# EAGLE design theWeather_A (EAGLE 5.11)

## Sheet 1 of 2
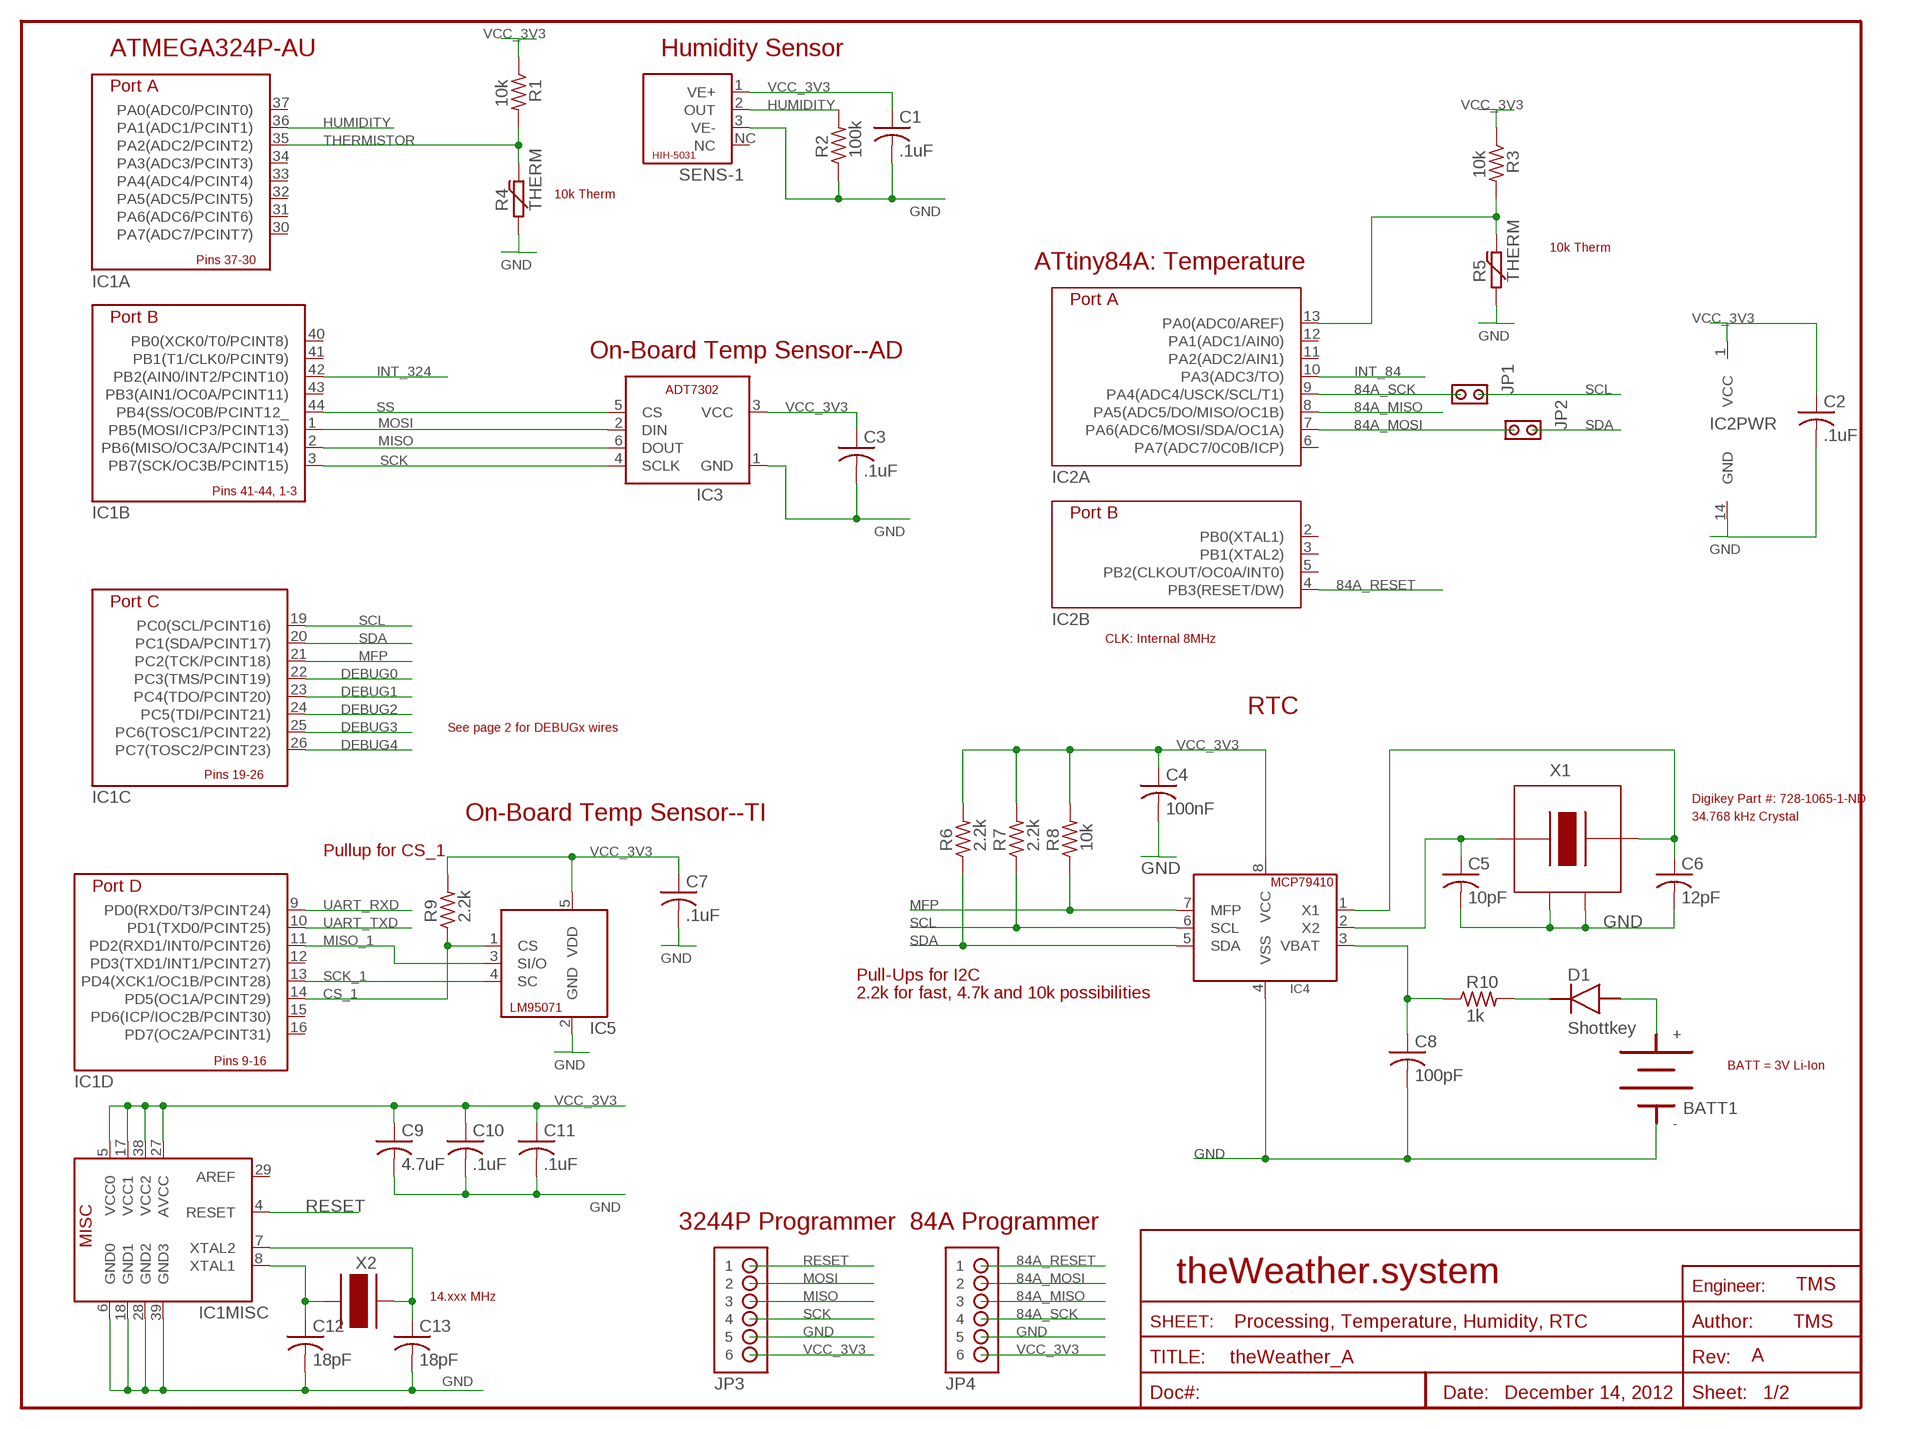
[diagram p0: schematic, sheet 1]

### Parts
BATT1  COINCELL-BR-1632A  [BR-1632A]
C1  .1uF  CAP-S0402  [C0402]
C2  .1uF  CAP-S0402  [C0402]
C3  .1uF  CAP-S0402  [C0402]
C4  100nF  CAP-S0603S  [C0603S]
C5  10pF  CAP-S0603  [C0603]
C6  12pF  CAP-S0603  [C0603]
C7  .1uF  CAP-S0402  [C0402]
C8  100pF  CAP-S0603  [C0603]
C9  4.7uF  CAP-S0603S  [C0603S]
C10  .1uF  CAP-S0402  [C0402]
C11  .1uF  CAP-S0402  [C0402]
C12  18pF  CAP-S0805S  [C0805S]
C13  18pF  CAP-S0805S  [C0805S]
D1  Shottkey  DIODE-DO-214AA  [DO-214AA]
IC1  ATMEGA1284P-AU  [TQFP44]
IC2  ATTINY24-SSU  [SOIC14]
IC3  ADT7302  [SOT23-6]
IC4  MCP79410-SOIC8  [SOIC8]
IC5  LM95071  [SOT23-5]
JP1  JPR-1X2  [JPR-1X2]
JP2  JPR-1X2  [JPR-1X2]
JP3  HDR-1X6-OFFSET  [HDR-1X6_OFFSET]
JP4  HDR-1X6-OFFSET  [HDR-1X6_OFFSET]
R1  10k  RES-S0402  [R0402]
R2  100k  RES-S0402  [R0402]
R3  10k  RES-S0402  [R0402]
R4  THERM  [2-HOLE]
R5  THERM  [2-HOLE]
R6  2.2k  RES-S0402  [R0402]
R7  2.2k  RES-S0402  [R0402]
R8  10k  RES-S0402  [R0402]
R9  2.2k  RES-S0402  [R0402]
R10  1k  RES-S0402  [R0402]
SENS-1  HIH-5031  [HIH-5031]
X1  SSPT7F-7PF20-R  [SSP-T7-FL]
X2  XTAL-TXC-7A  [TXC-7A-SERIES]

### Nets
84A_MISO: IC2.8(A:PA5(ADC5/DO/MISO/OC1B)) JP4.3
84A_MOSI: IC2.7(A:PA6(ADC6/MOSI/SDA/OC1A)) JP2.1 JP4.2
84A_RESET: IC2.4(B:PB3(RESET/DW)) JP4.1
84A_SCK: IC2.9(A:PA4(ADC4/USCK/SCL/T1)) JP1.1 JP4.4
CS_1: IC1.14(D:PD5(OC1A/PCINT29)) IC5.1(CS) R9.1
DEBUG0: IC1.22(C:PC3(TMS/PCINT19)) ; also sheet 2
DEBUG1: IC1.23(C:PC4(TDO/PCINT20)) ; also sheet 2
DEBUG2: IC1.24(C:PC5(TDI/PCINT21)) ; also sheet 2
DEBUG3: IC1.25(C:PC6(TOSC1/PCINT22)) ; also sheet 2
DEBUG4: IC1.26(C:PC7(TOSC2/PCINT23)) ; also sheet 2
GND: BATT1.- C1.2 C2.2 C3.2 C4.2 C5.2 C6.2 C7.2 C8.2 C9.2 C10.2 C11.2 C12.2 C13.2 IC1.6(MISC:GND0) IC1.18(MISC:GND1) IC1.28(MISC:GND2) IC1.39(MISC:GND3) IC2.14(PWR:GND) IC3.1(GND) IC4.4(VSS) IC5.2(GND) JP3.5 JP4.5 R2.1 R4.1 R5.1 SENS-1.3(VE-) X1.2(G2) X1.3(G1) ; also sheet 2
HUMIDITY: IC1.36(A:PA1(ADC1/PCINT1)) R2.2 SENS-1.2(OUT)
INT_84: IC2.10(A:PA3(ADC3/TO)) ; also sheet 2
INT_324: IC1.42(B:PB2(AIN0/INT2/PCINT10)) ; also sheet 2
MFP: IC1.21(C:PC2(TCK/PCINT18)) IC4.7(MFP) R8.1
MISO: IC1.2(B:PB6(MISO/OC3A/PCINT14)) IC3.6(DOUT) JP3.3
MISO_1: IC1.11(D:PD2(RXD1/INT0/PCINT26)) IC5.3(SI/O)
MOSI: IC1.1(B:PB5(MOSI/ICP3/PCINT13)) IC3.2(DIN) JP3.2
N$3: C13.1 IC1.7(MISC:XTAL2) X2.P$1
N$6: C6.1 IC4.1(X1) X1.4
N$8: C12.1 IC1.8(MISC:XTAL1) X2.P$2
N$10: C8.1 IC4.3(VBAT) R10.1
N$11: BATT1.+ D1.ANODE(A)
N$12: D1.CATH(C) R10.2
N$13: IC2.13(A:PA0(ADC0/AREF)) R3.2 R5.2
N$23: C5.1 IC4.2(X2) X1.1
RESET: IC1.4(MISC:RESET) JP3.1
SCK: IC1.3(B:PB7(SCK/OC3B/PCINT15)) IC3.4(SCLK) JP3.4
SCK_1: IC1.13(D:PD4(XCK1/OC1B/PCINT28)) IC5.4(SC)
SCL: IC1.19(C:PC0(SCL/PCINT16)) IC4.6(SCL) JP1.2 R7.1 ; also sheet 2
SDA: IC1.20(C:PC1(SDA/PCINT17)) IC4.5(SDA) JP2.2 R6.1 ; also sheet 2
SS: IC1.44(B:PB4(SS/OC0B/PCINT12_) IC3.5(CS)
THERMISTOR: IC1.35(A:PA2(ADC2/PCINT2)) R1.2 R4.2
UART_RXD: IC1.9(D:PD0(RXD0/T3/PCINT24)) ; also sheet 2
UART_TXD: IC1.10(D:PD1(TXD0/PCINT25)) ; also sheet 2
VCC_3V3: C1.1 C2.1 C3.1 C4.1 C7.1 C9.1 C10.1 C11.1 IC1.5(MISC:VCC0) IC1.17(MISC:VCC1) IC1.27(MISC:AVCC) IC1.38(MISC:VCC2) IC2.1(PWR:VCC) IC3.3(VCC) IC4.8(VCC) IC5.5(VDD) JP3.6 JP4.6 R1.1 R3.1 R6.2 R7.2 R8.2 R9.2 SENS-1.1(VE+) ; also sheet 2
Unconnected: IC1.12(D:PD3(TXD1/INT1/PCINT27)) IC1.15(D:PD6(ICP/IOC2B/PCINT30)) IC1.16(D:PD7(OC2A/PCINT31)) IC1.29(MISC:AREF) IC1.30(A:PA7(ADC7/PCINT7)) IC1.31(A:PA6(ADC6/PCINT6)) IC1.32(A:PA5(ADC5/PCINT5)) IC1.33(A:PA4(ADC4/PCINT4)) IC1.34(A:PA3(ADC3/PCINT3)) IC1.37(A:PA0(ADC0/PCINT0)) IC1.40(B:PB0(XCK0/T0/PCINT8)) IC1.41(B:PB1(T1/CLK0/PCINT9)) IC1.43(B:PB3(AIN1/OC0A/PCINT11)) IC2.2(B:PB0(XTAL1)) IC2.3(B:PB1(XTAL2)) IC2.5(B:PB2(CLKOUT/OC0A/INT0)) IC2.6(A:PA7(ADC7/0C0B/ICP)) IC2.11(A:PA2(ADC2/AIN1)) IC2.12(A:PA1(ADC1/AIN0)) SENS-1.NC

### Notes on the sheet
- ATMEGA324P-AU | Humidity Sensor
- 10k Therm
- 10k Therm
- ATtiny84A: Temperature
- On-Board Temp Sensor--AD
- CLK: Internal 8MHz
- RTC
- See page 2 for DEBUGx wires
- Digikey Part #: 728-1065-1-ND
- On-Board Temp Sensor--TI | 34.768 kHz Crystal
- Pullup for CS_1
- Pull-Ups for I2C
- 2.2k for fast, 4.7k and 10k possibilities
- BATT = 3V Li-Ion
- 3244P Programmer | 84A Programmer
- theWeather.system
- TMS
- 14.xxx MHz
- Processing, Temperature, Humidity, RTC | TMS
- A
- December 14, 2012

## Sheet 2 of 2
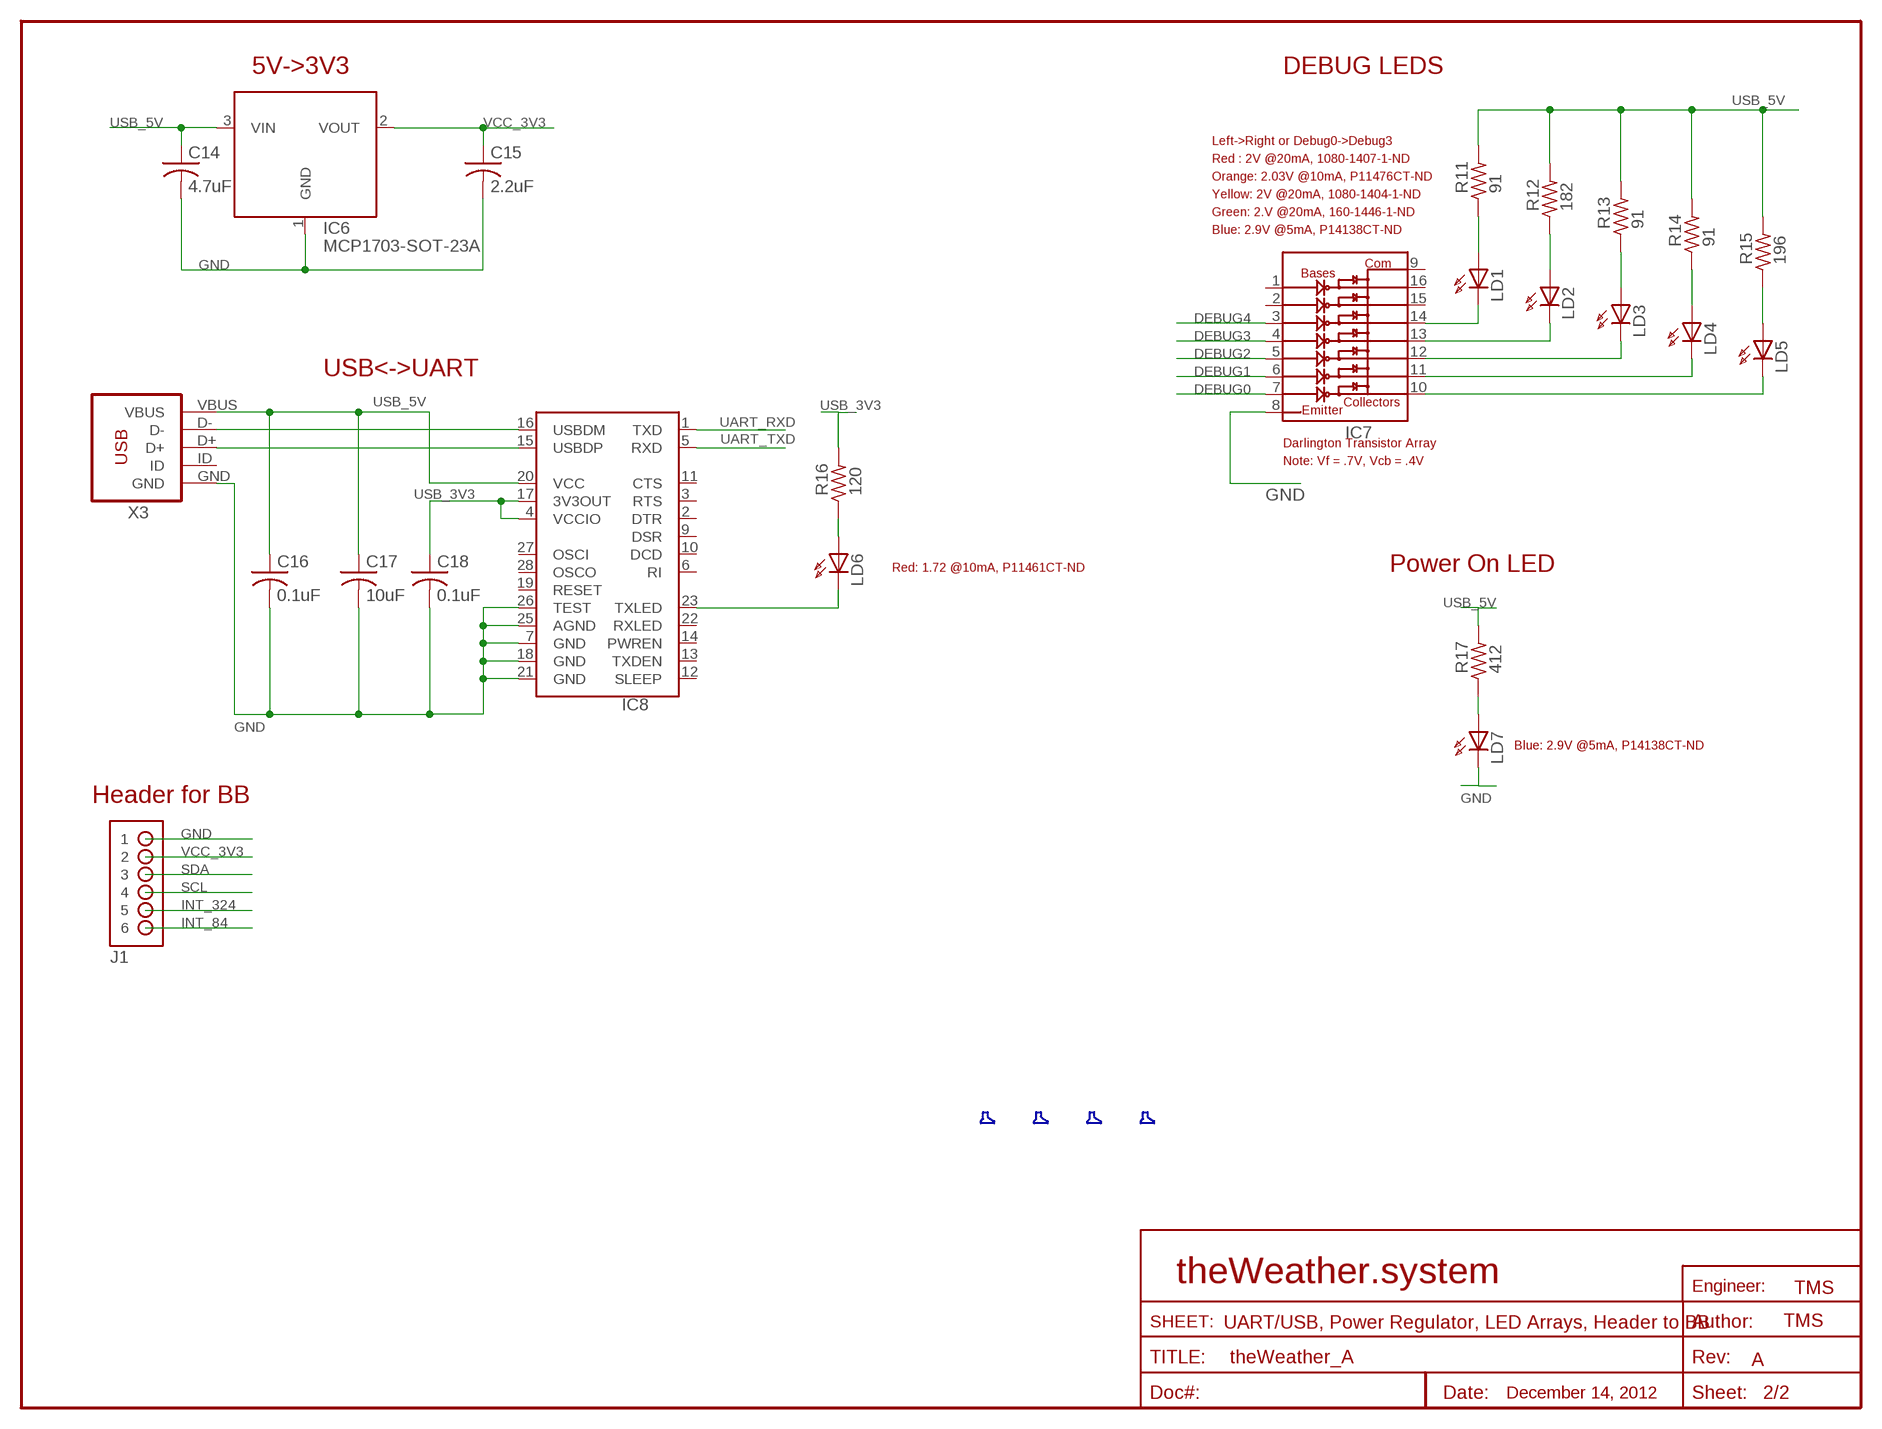
[diagram p1: schematic, sheet 2]

### Parts
C14  4.7uF  CAP-S0603S  [C0603S]
C15  2.2uF  CAP-S0603S  [C0603S]
C16  0.1uF  CAP-S0402P  [C0402P]
C17  10uF  CAP-S0603S  [C0603S]
C18  0.1uF  CAP-S0402P  [C0402P]
F1  FOOT  [FOOT#6]
F2  FOOT  [FOOT#6]
F3  FOOT  [FOOT#6]
F4  FOOT  [FOOT#6]
IC6  MCP1703-SOT-23A  [SOT-23A]
IC7  ULQ2004A-Q1-TSSOP-16  [TSSOP-16]
IC8  FT232R  [SSOP28L]
J1  HDR-2X3  [HDR-2X3]
LD1  LED-S0603  [D0603]
LD2  LED-S0603  [D0603]
LD3  LED-S0603  [D0603]
LD4  LED-S0603  [D0603]
LD5  LED-S0603  [D0603]
LD6  LED-S0603  [D0603]
LD7  LED-S0603  [D0603]
R11  91  RES-S0402  [R0402]
R12  182  RES-S0402  [R0402]
R13  91  RES-S0402  [R0402]
R14  91  RES-S0402  [R0402]
R15  196  RES-S0402  [R0402]
R16  120  RES-S0402  [R0402]
R17  412  RES-S0402  [R0402]
X3  USB-MINI-B-OTG-MOLEX_67503-1020  [USB-MINI-B-OTG]

### Nets
DEBUG0: IC7.7 ; also sheet 1
DEBUG1: IC7.6 ; also sheet 1
DEBUG2: IC7.5 ; also sheet 1
DEBUG3: IC7.4 ; also sheet 1
DEBUG4: IC7.3 ; also sheet 1
GND: C14.2 C15.2 C16.2 C17.2 C18.2 IC6.1(GND) IC7.8 IC8.7(GND) IC8.18(GND) IC8.21(GND) IC8.25(AGND) IC8.26(TEST) J1.1 LD7.C X3.GND ; also sheet 1
INT_84: J1.6 ; also sheet 1
INT_324: J1.5 ; also sheet 1
N$2: IC8.16(USBDM) X3.D-
N$4: LD6.A R16.1
N$5: IC8.15(USBDP) X3.D+
N$9: IC8.23(TXLED) LD6.C
N$14: LD1.A R11.1
N$15: LD2.A R12.1
N$16: LD3.A R13.1
N$17: LD4.A R14.1
N$18: IC7.14 LD1.C
N$19: LD7.A R17.1
N$20: IC7.13 LD2.C
N$21: IC7.12 LD3.C
N$22: IC7.11 LD4.C
N$24: IC7.10 LD5.C
N$25: LD5.A R15.1
SCL: J1.4 ; also sheet 1
SDA: J1.3 ; also sheet 1
UART_RXD: IC8.1(TXD) ; also sheet 1
UART_TXD: IC8.5(RXD) ; also sheet 1
USB_3V3: C18.1 IC8.4(VCCIO) IC8.17(3V3OUT) R16.2
USB_5V: C14.1 C16.1 C17.1 IC6.3(VIN) IC8.20(VCC) R11.2 R12.2 R13.2 R14.2 R15.2 R17.2 X3.VBUS
VCC_3V3: C15.1 IC6.2(VOUT) J1.2 ; also sheet 1
Unconnected: IC7.1 IC7.2 IC7.9 IC7.15 IC7.16 IC8.2(DTR) IC8.3(RTS) IC8.6(RI) IC8.9(DSR) IC8.10(DCD) IC8.11(CTS) IC8.12(SLEEP) IC8.13(TXDEN) IC8.14(PWREN) IC8.19(RESET) IC8.22(RXLED) IC8.27(OSCI) IC8.28(OSCO) X3.ID

### Notes on the sheet
- 5V->3V3 | DEBUG LEDS
- Left->Right or Debug0->Debug3
- Red : 2V @20mA, 1080-1407-1-ND
- Orange: 2.03V @10mA, P11476CT-ND
- Yellow: 2V @20mA, 1080-1404-1-ND
- Green: 2.V @20mA, 160-1446-1-ND
- Blue: 2.9V @5mA, P14138CT-ND
- USB<->UART
- Darlington Transistor Array
- Note: Vf = .7V, Vcb = .4V
- Red: 1.72 @10mA, P11461CT-ND | Power On LED
- Blue: 2.9V @5mA, P14138CT-ND
- Header for BB
- theWeather.system
- TMS
- UART/USB, Power Regulator, LED Arrays, Header to BB | TMS
- A
- December 14, 2012

## Library data of the parts
BATT1 = Mechanical:COINCELL
C1-C18 = Discrete:CAP: Capacitor
D1 = Discrete:DIODE: Diode
F1-F4 = Mechanical:FOOT: Foot (ie. #6 screw, or Rubber)
IC1 = Atmel:ATMEGA1284P-AU: Atmega1284P-AU, TQFP44 Package, Digikey: ATMEGA1284P-AURCT-ND, 128kb Flash, 3 SPI, 2 USART, 1 I2C
IC2 = Atmel:ATTINY24: ATtiny24-44-84 AVR Microcontroller
IC3 = IC:ADT7302: Analog Devices Digital Thermometer, Digikey Part Number: ADT7302ARTZ-REEL7CT-ND, Takes ADC reading and then talks via 3/4 wire SPI to a uC
IC4 = IC:MCP79410: Digi-Key Part Number MCP79410-I/SN-ND Manufacturer Part Number MCP79410-I/SN Description IC RTC ALARM NVSRAM 8SOIC Microchip MCP79410 The MCP7941X series of low-power Real-Time Clocks (RTC) uses digital timing compensation for an accurate clock/calendar, a programmable output control for versatility, a power sense circuit that automatically switches to the backup supply, and nonvolatile memory for data storage. Using a low-cost 32.768 kHz crystal, it tracks time using several internal registers. For communication, the MCP7941X uses the I2C? bus.
IC5 = TI:LM95071: Texas Instruments Temperature Sensor, Digikey Part Number: LM95071CIMF/NOPBCT-ND
IC6 = Microchip:MCP1703: Digi-Key Part Number MCP1703T-3302E/CBCT-ND Manufacturer Microchip Technology Manufacturer Part Number MCP1703T-3302E/CB Description IC REG LDO 3.3V 250MA SOT-23A
IC7 = Discrete:ULQ2004A-Q1: Digi-Key Part Number 296-27409-1-ND Manufacturer Texas Instruments Manufacturer Part Number ULQ2003ATPWRQ1 Description IC DARLINGTN TRANS ARRAY 16TSSOP The ULQ2003A and ULQ2004A are high-voltage high-current Darlington transistor arrays. Each consists of seven npn Darlington pairs that feature high-voltage outputs with common-cathode clamp diodes for switching inductive loads. The collector-current rating of a single Darlington pair is 500 mA. The Darlington pairs can be paralleled for higher current capability. Applications include relay drivers, hammer drivers, lamp drivers, display drivers (LED and gas discharge), line drivers, and logic buffers.
IC8 = IC:FT232R: The FT232R is a USB to serial UART interface with the following advanced features: Data transfer rates from 300 baud to 3 Mbaud (RS422, RS485, RS232 ) at TTL levels. 128 byte receive buffer and 256 byte transmit buffer utilising buffer smoothing technology to allow for high data throughput. FTDI?s royalty-free Virtual Com Port (VCP) and Direct (D2XX) drivers eliminate the requirement
J1 = Mechanical:HDR-2X3
JP1 JP2 = Mechanical:JPR-1X2
JP3 JP4 = Mechanical:HDR-1X6-OFFSET: 42 mil hole pattern with 16mil offset for jtag connector
LD1-LD7 = Discrete:LED: Discrete LED
R1-R3 R6-R17 = Discrete:RES: Resistor
R4 R5 = Discrete:THERM: Standard Thermistor. 2-Hole Digikey Part # 615-1083-ND
SENS-1 = Misc:HIH-5031: Honeywell Humidity Sensor, Manufacture Part #: HIH-5031, Digikey Part #: 480-3294-2-ND
X1 = Discrete:SSPT7F-7PF20-R
X2 = Discrete:XTAL: Quartz Crystal
X3 = Mechanical:USB-MINI-B-OTG: Molex 67503-1020 USB mini B connector with through hole anchors.

## Board
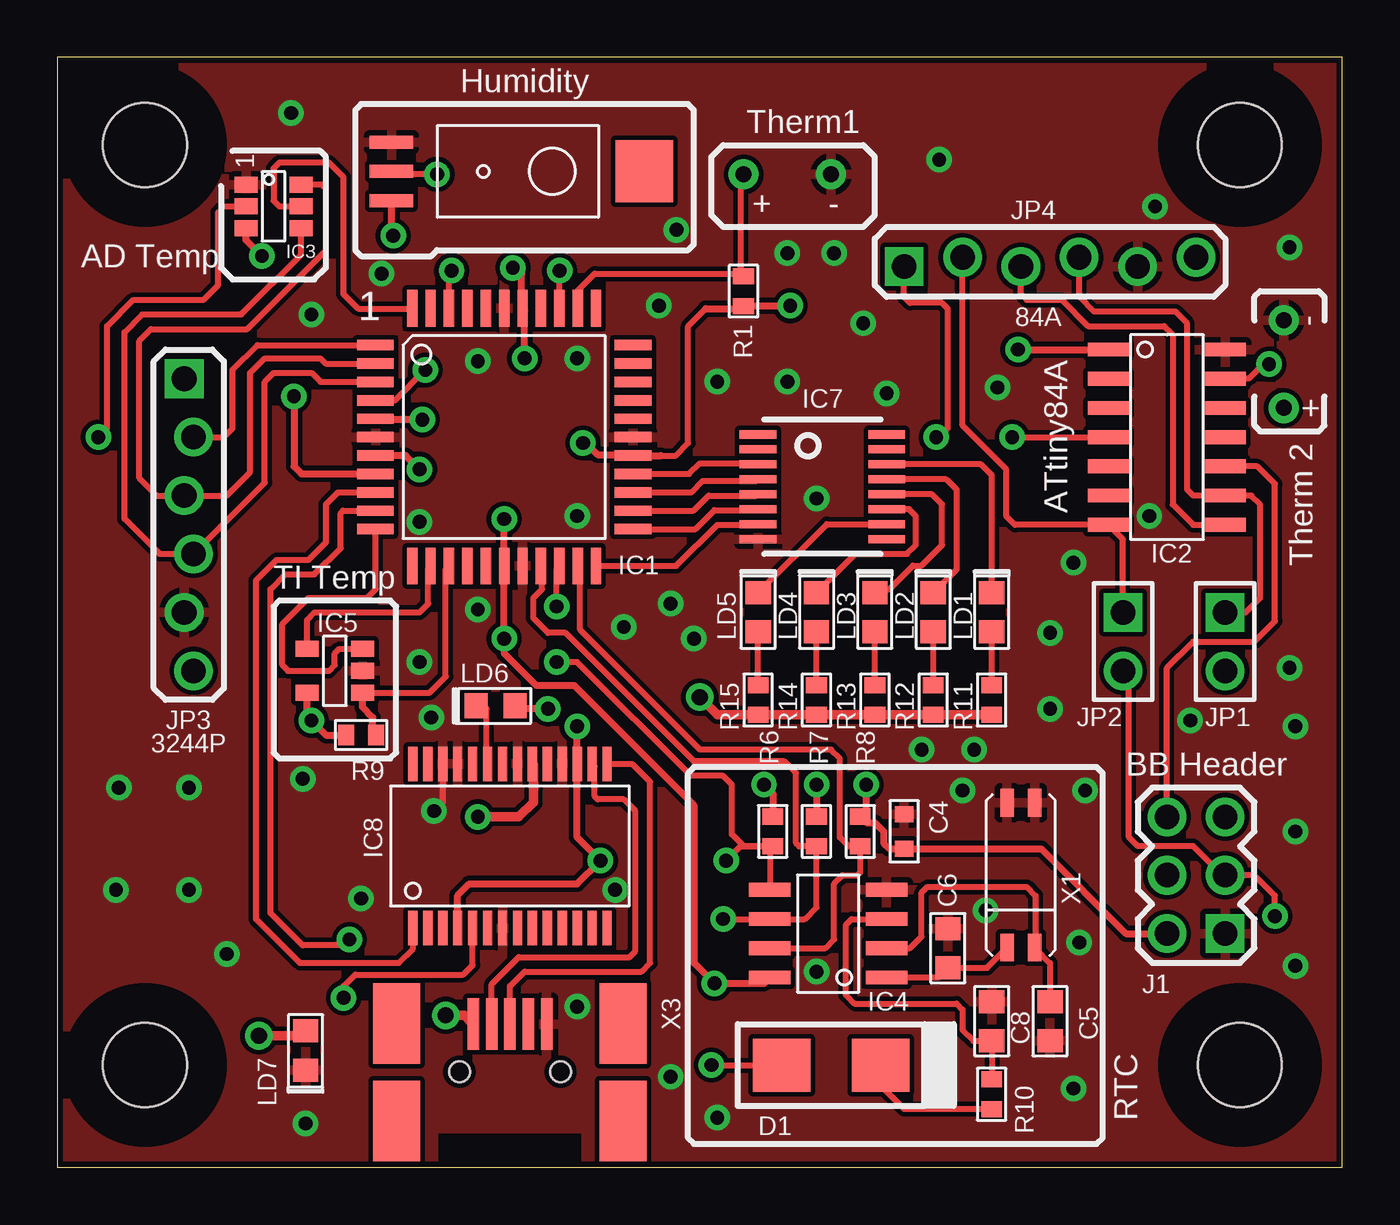
[diagram p2: board, top side]
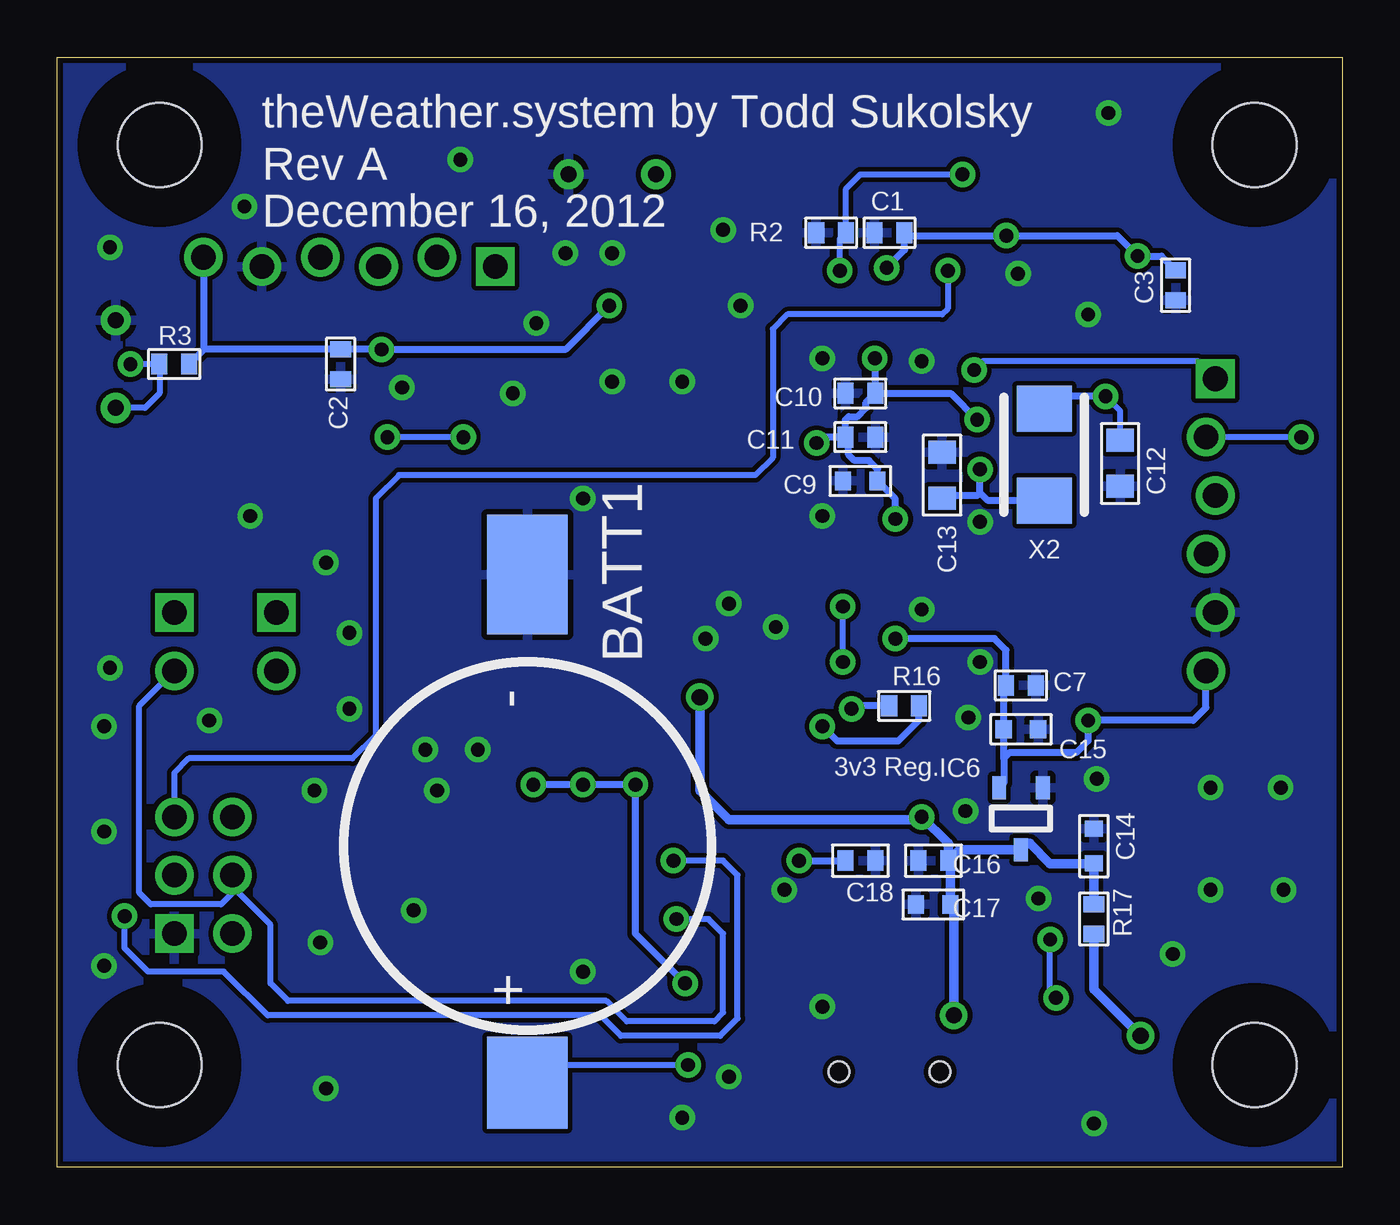
[diagram p3: board, bottom side, seen from below]

Size 55.88 x 48.26 mm. Coordinates in mm from the lower left corner, seen from the top.
Outline: 0,0 55.88,0 55.88,48.26 0,48.26 0,0
Copper layers (1*16): Top 0.035mm / dielectric 1.5mm / Bottom 0.035mm
Design rules "batchPCB": minimum track width 8mil, minimum drill 20mil, track to track 8mil, track to pad 8mil, pad to pad 8mil, via to via 8mil, smd to smd 8mil, copper to edge 10mil, drill to drill 8mil, minimum pad ring 12mil, minimum via ring 10mil, stop-mask expansion 4mil, vias tented up to drill 25mil, thermal gap 10mil

### Footprints (pad centres in the part's own frame; a part is rotated, then mirrored left to right if it is on the bottom)
BR-1632A = smd 4 x 3.5: + -10.3,0 | smd 5.2 x 3.5: - 11.8,0
C0402 = smd 0.7 x 0.9: 1 -0.65,0; 2 0.65,0
C0603S = smd 0.7 x 0.8: 1 -0.75,0; 2 0.75,0
C0603 = smd 1 x 1.1: 1 -0.85,0; 2 0.85,0
C0805S = smd 1 x 1.2: 1 -1,0; 2 1,0
C0402P = smd 0.7 x 0.9: 1 -0.65,0; 2 0.65,0
DO-214AA = smd 2.5 x 2.3: ANODE -2.15,0; CATH 2.15,0
FOOT#6 = hole 3.658: 0,0
TQFP44 = smd 1.6 x 0.45: 1 -5.6,4; 2 -5.6,3.2; 3 -5.6,2.4; 4 -5.6,1.6; 5 -5.6,0.8; 6 -5.6,0; 7 -5.6,-0.8; 8 -5.6,-1.6; 9 -5.6,-2.4; 10 -5.6,-3.2; 11 -5.6,-4; 23 5.6,-4; 24 5.6,-3.2; 25 5.6,-2.4; 26 5.6,-1.6; 27 5.6,-0.8; 28 5.6,0; 29 5.6,0.8; 30 5.6,1.6; 31 5.6,2.4; 32 5.6,3.2; 33 5.6,4 | smd 0.45 x 1.6: 12 -4,-5.6; 13 -3.2,-5.6; 14 -2.4,-5.6; 15 -1.6,-5.6; 16 -0.8,-5.6; 17 0,-5.6; 18 0.8,-5.6; 19 1.6,-5.6; 20 2.4,-5.6; 21 3.2,-5.6; 22 4,-5.6; 34 4,5.6; 35 3.2,5.6; 36 2.4,5.6; 37 1.6,5.6; 38 0.8,5.6; 39 0,5.6; 40 -0.8,5.6; 41 -1.6,5.6; 42 -2.4,5.6; 43 -3.2,5.6; 44 -4,5.6
SOIC14 = smd 0.6 x 1.8: 1 -3.81,-2.54; 2 -2.54,-2.54; 3 -1.27,-2.54; 4 0,-2.54; 5 1.27,-2.54; 6 2.54,-2.54; 7 3.81,-2.54; 8 3.81,2.54; 9 2.54,2.54; 10 1.27,2.54; 11 0,2.54; 12 -1.27,2.54; 13 -2.54,2.54; 14 -3.81,2.54
SOT23-6 = smd 0.7 x 1: 1 -0.95,-1.2; 2 0,-1.2; 3 0.95,-1.2; 4 0.95,1.2; 5 0,1.2; 6 -0.95,1.2
SOIC8 = smd 0.6 x 1.8: 1 -1.905,-2.54; 2 -0.635,-2.54; 3 0.635,-2.54; 4 1.905,-2.54; 5 1.905,2.54; 6 0.635,2.54; 7 -0.635,2.54; 8 -1.905,2.54
SOT23-5 = smd 0.7 x 1: 1 -0.95,-1.2; 2 0,-1.2; 3 0.95,-1.2; 4 0.95,1.2; 5 -0.95,1.2
SOT-23A = smd 0.6 x 1: 1 -0.95,0; 2 0.95,0; 3 0,2.7
TSSOP-16 = smd 0.35 x 1.6: 1 -2.275,-2.8; 2 -1.625,-2.8; 3 -0.975,-2.8; 4 -0.325,-2.8; 5 0.325,-2.8; 6 0.975,-2.8; 7 1.625,-2.8; 8 2.275,-2.8; 9 2.275,2.8; 10 1.625,2.8; 11 0.975,2.8; 12 0.325,2.8; 13 -0.325,2.8; 14 -0.975,2.8; 15 -1.625,2.8; 16 -2.275,2.8
SSOP28L = smd 0.4 x 1.5: 1 -4.225,-3.575; 2 -3.575,-3.575; 3 -2.925,-3.575; 4 -2.275,-3.575; 5 -1.625,-3.575; 6 -0.975,-3.575; 7 -0.325,-3.575; 8 0.325,-3.575; 9 0.975,-3.575; 10 1.625,-3.575; 11 2.275,-3.575; 12 2.925,-3.575; 13 3.575,-3.575; 14 4.225,-3.575; 15 4.225,3.575; 16 3.575,3.575; 17 2.925,3.575; 18 2.275,3.575; 19 1.625,3.575; 20 0.975,3.575; 21 0.325,3.575; 22 -0.325,3.575; 23 -0.975,3.575; 24 -1.625,3.575; 25 -2.275,3.575; 26 -2.925,3.575; 27 -3.575,3.575; 28 -4.225,3.575
HDR-2X3 = drill 1.067 square: 1 -1.27,2.54 | drill 1.067 round: 2 1.27,2.54; 3 -1.27,0; 4 1.27,0; 5 -1.27,-2.54; 6 1.27,-2.54
JPR-1X2 = drill 1.067 square: 1 0,1.27 | drill 1.067 round: 2 0,-1.27
HDR-1X6_OFFSET = drill 1.067 square: 1 -0.203,6.35 | drill 1.067 round: 2 0.203,3.81; 3 -0.203,1.27; 4 0.203,-1.27; 5 -0.203,-3.81; 6 0.203,-6.35
D0603 = smd 1 x 1.1: A 0.85,0; C -0.85,0
R0402 = smd 0.7 x 0.9: 1 -0.65,0; 2 0.65,0
2-HOLE = drill 0.7 round: 1 -1.905,0; 2 1.905,0
HIH-5031 = smd 0.57 x 1.9: 1 1.27,-11; 2 0,-11; 3 -1.27,-11 | smd 2.7 x 2.5: NC 0,0
SSP-T7-FL = smd 1.2 x 0.6: 1 -3.15,-0.6; 2 3.15,-0.6; 3 3.15,0.6; 4 -3.15,0.6
TXC-7A-SERIES = smd 2 x 2.4: P$1 -2,0; P$2 2,0
USB-MINI-B-OTG = smd 2.25 x 0.5: D+ 5.975,0; D- 5.975,0.8; GND 5.975,-1.6; ID 5.975,-0.8; VBUS 5.975,1.6 | smd 3.5 x 2.05: SHLD1 1.75,4.925; SHLD2 6,4.925; SHLD3 1.75,-4.925; SHLD4 6,-4.925 | hole 0.9: 3.9,2.2; 3.9,-2.2

### Placement (x,y rotation side)
BATT1  35.43,13.97 90 bottom
C1  19.68,40.64 180 bottom
C2  43.56,34.92 270 bottom
C3  7.24,38.35 270 bottom
C4  36.83,14.61 90 top
C5  43.18,6.35 270 top
C6  38.73,9.53 90 top
C7  13.97,20.95 0 bottom
C8  40.64,6.35 90 top
C9  20.95,29.84 180 bottom
C10  20.95,33.66 180 bottom
C11  20.95,31.75 0 bottom
C12  9.65,30.61 270 bottom
C13  17.4,30.1 90 bottom
C14  10.79,13.97 90 bottom
C15  13.97,19.05 0 bottom
C16  17.78,13.34 180 bottom
C17  17.78,11.43 180 bottom
C18  20.95,13.34 0 bottom
D1  33.66,4.45 0 top
F1  51.44,4.45 0 top
F2  3.81,4.45 0 top
F3  3.81,44.45 0 top
F4  51.44,44.45 0 top
IC1  19.43,31.75 0 top
IC2  48.26,31.75 270 top
IC3  9.4,41.78 270 top
IC4  33.53,10.16 90 top
IC5  12.06,21.59 90 top
IC6  13.97,16.51 180 bottom
IC7  33.27,29.59 270 top
IC8  19.68,13.97 0 top
J1  49.53,12.7 180 top
JP1  50.8,22.86 0 top
JP2  46.35,22.86 0 top
JP3  5.71,27.94 0 top
JP4  43.18,39.37 90 top
LD1  40.64,24.13 270 top
LD2  38.1,24.13 270 top
LD3  35.56,24.13 270 top
LD4  33.02,24.13 270 top
LD5  30.48,24.13 270 top
LD6  19.05,20.07 0 top
LD7  10.79,5.08 90 top
R1  29.84,38.1 90 top
R2  22.23,40.64 0 bottom
R3  50.8,34.92 180 bottom
R4  31.75,43.18 180 top
R5  53.34,34.92 270 top
R6  31.11,14.61 90 top
R7  33.02,14.61 90 top
R8  34.92,14.61 90 top
R9  13.21,18.8 180 top
R10  40.64,3.17 270 top
R11  40.64,20.32 270 top
R12  38.1,20.32 270 top
R13  35.56,20.32 270 top
R14  33.02,20.32 270 top
R15  30.48,20.32 270 top
R16  19.05,20.07 0 bottom
R17  10.79,10.79 90 bottom
SENS-1  25.53,43.31 270 top
X1  41.91,12.7 90 top
X2  12.95,30.99 90 bottom
X3  19.68,0.25 90 top

### Tracks (layer width: path | path; a pad name or v marks a point on that pad's centre or on a via)
84A_MISO
  Top 0.254: IC2.8 49.4,27.94 48.51,28.83 48.51,36.2 48.13,36.58 44.83,36.58 43.69,37.72 42.16,37.72 41.91,37.97 JP4.3
84A_MOSI
  Top 0.254: JP2.1 46.35,27.3 IC2.7 41.66,27.94 41.27,28.32 41.27,30.35 39.37,32.26 JP4.2
84A_RESET  (via drill 0.6)
  Top 0.254: v41.53,31.75 IC2.4 | v38.23,31.75 38.35,31.75 38.73,32.13 38.73,37.34 38.48,37.59 37.08,37.59 36.83,37.85 JP4.1
  Bottom 0.254: v38.23,31.75 v41.53,31.75
84A_SCK
  Top 0.254: JP1.1 51.69,24.13 52.32,24.77 52.32,28.83 51.94,29.21 IC2.9 49.4,29.21 49.15,29.46 49.15,36.7 48.64,37.21 45.09,37.21 44.45,37.85 JP4.4
CS_1
  Top 0.254: IC5.1 16.2,20.64 16.89,21.34 16.89,26.01 IC1.14
  Top 0.305: IC5.1 13.27,20.01 13.72,19.56 13.72,18.94 R9.1
DEBUG0
  Top 0.254: IC1.22 26.91,26.15 28.7,27.94 30.45,27.94 IC7.7
DEBUG1
  Top 0.254: IC1.23 27.75,27.75 28.57,28.57 30.43,28.57 IC7.6
DEBUG2
  Top 0.254: IC1.24 27.66,28.55 28.32,29.21 30.42,29.21 IC7.5
DEBUG3
  Top 0.254: IC1.25 27.57,29.35 28.07,29.84 30.4,29.84 IC7.4
DEBUG4
  Top 0.254: IC1.26 27.48,30.15 27.94,30.61 30.43,30.61 IC7.3
GND  (via drill 0.6)
  Top 0.254: IC8.26 16.76,15.87 v16.38,15.49
  other vias: 22.61,6.99 15.75,21.97 16.26,19.56 7.37,9.27 24.26,12.06 40.39,11.18 10.67,16.89 13.21,11.68 11.05,37.08 14.1,38.86 18.29,35.05 2.67,16.51 5.71,16.51 2.54,12.06 5.71,12.06 10.79,1.91 18.29,24.26 24.64,23.5 26.67,24.51 27.69,22.99 22.61,28.32 15.75,28.07 22.61,35.18 28.7,34.16 31.75,34.16 33.02,29.08 36.07,33.66 44.2,26.29 40.89,33.91 35.05,36.7 33.78,39.75 26.16,37.47 26.92,40.77 10.16,45.85 38.35,43.81 31.75,39.75 47.75,41.78 53.59,40.01 47.5,28.32 43.18,23.24 53.59,21.72 49.28,19.43 43.18,19.94 37.59,18.16 39.88,18.16 39.37,16.38 44.7,16.38 44.45,9.78 44.2,3.43 28.7,2.16 33.02,8.51 26.67,3.94 53.85,8.76 53.85,14.61 53.85,19.18
  pour Bottom: 0,48.26 55.88,48.26 55.88,0 0,0
  pour Top: 0,48.26 55.88,48.26 55.88,0 0,0
HUMIDITY  (via drill 0.6)
  Top 0.254: IC1.36 21.83,38.98 v21.84,38.99 | v16.51,43.18 14.65,43.18 SENS-1.2
  Bottom 0.254: v21.84,38.99 21.84,40.37 R2.2 21.57,42.56 20.95,43.18 v16.51,43.18
INT_84
  Top 0.254: J1.6 48.26,21.72 49.4,22.86 52.07,22.86 52.96,23.75 52.96,29.72 52.2,30.48 IC2.10
INT_324  (via drill 0.6)
  Top 0.254: IC1.42 17.03,38.88 v17.14,38.99
  Bottom 0.254: v17.14,38.99 17.14,37.34 17.4,37.08 24.13,37.08 24.77,36.45 24.77,30.86 25.53,30.1 41.02,30.1 42.04,29.08 42.04,18.8 43.05,17.78 50.16,17.78 50.8,17.14 J1.5
MFP
  Top 0.254: IC4.7 33.4,9.53 33.78,9.91 33.78,12.32 34.16,12.7 34.8,12.7 34.92,12.83 R8.1 34.43,13.96 34.04,14.35 34.04,17.78 33.66,18.16 27.94,18.16 22.73,23.37 22.73,26.05 IC1.21
MISO
  Top 0.254: IC1.2 11.66,34.95 11.43,35.18 9.02,35.18 8.38,34.54 8.38,30.23 7.37,29.21 JP3.3 4.32,29.21 3.56,29.97 3.56,35.94 4.06,36.45 8.26,36.45 11.68,39.88 11.68,42.55 11.5,42.73 IC3.6
MISO_1
  Top 0.254: IC5.3 12.25,22.54 12.06,22.35 12.06,21.84 11.81,21.59 10.03,21.59 9.78,21.84 9.78,23.62 10.92,24.77 13.46,24.77 13.84,25.15 13.84,27.74 IC1.11
MOSI  (via drill 0.6)
  Top 0.254: IC1.1 8.7,35.75 7.62,34.67 7.62,32.13 7.24,31.75 JP3.2 | IC3.2 7.24,41.78 6.99,41.53 6.99,38.35 6.35,37.72 3.3,37.72 2.16,36.58 2.16,32.13 v1.78,31.75
  Bottom 0.254: v1.78,31.75 JP3.2
N$2
  Top 0.254: X3.D- 18.89,7.96 20.07,9.14 24.89,9.14 25.15,9.4 25.15,15.49 24.64,16 23.5,16 23.37,16.13 23.37,17.44 IC8.16
N$3  (via drill 0.6)
  Top 0.305: IC1.7 15.15,30.95 v15.75,30.35
  Bottom 0.305: 15.75,29.34 v15.75,30.35 | 15.75,29.34 15.88,29.21 17.29,29.21 C13.1 | X2.P$1 15.4,28.99 15.75,29.34
N$4  (via drill 0.6)
  Top 0.305: v21.34,19.94 20.03,19.94 LD6.A
  Bottom 0.305: R16.1 21.21,20.07 v21.34,19.94
N$5
  Top 0.254: X3.D+ 19.68,7.87 20.32,8.51 25.4,8.51 25.78,8.89 25.78,16.76 25.02,17.53 23.93,17.53 IC8.15
N$6
  Top 0.254: IC4.1 38.31,8.26 C6.1 40.44,8.68 X1.4
N$8  (via drill 0.6)
  Top 0.305: IC1.8 10.62,30.15 10.29,30.48 v10.29,33.53
  Bottom 0.254: C12.1 9.65,32.89 v10.29,33.53
  Bottom 0.305: v10.29,33.53 12.41,33.53 X2.P$2
N$9
  Top 0.254: LD6.C 18.54,20.07 18.67,19.94 18.67,17.59 IC8.23
N$10
  Top 0.254: R10.1 C8.1 39.84,5.5 39.37,5.97 39.37,6.86 39.12,7.11 34.67,7.11 34.29,7.49 34.29,10.54 34.54,10.79 IC4.3
N$11  (via drill 0.6)
  Top 0.254: v28.45,4.45 D1.ANODE
  Bottom 0.254: v28.45,4.45 34.66,4.45 BATT1.+
N$12
  Top 0.254: D1.CATH 35.8,3.56 36.83,2.54 40.62,2.54 R10.2
N$13  (via drill 0.6)
  Top 0.254: v52.7,34.92 52.45,34.92 51.82,34.29 IC2.13
  Bottom 0.254: v52.7,34.92 R3.2 51.44,34.91 51.44,33.66 52.07,33.02 R5.2
N$14
  Top 0.254: R11.1 LD1.A
N$15
  Top 0.254: R12.1 LD2.A
N$16
  Top 0.254: R13.1 LD3.A
N$17
  Top 0.254: R14.1 LD4.A
N$18
  Top 0.254: IC7.14 40.17,30.57 40.64,30.1 LD1.C
N$19  (via drill 0.7)
  Top 0.406: v8.76,5.71 10.58,5.71 LD7.A
  Bottom 0.406: R17.1 10.79,7.75 v8.76,5.71
N$20
  Top 0.254: IC7.13 38.66,29.92 39.12,29.46 39.12,26 LD2.C
N$21
  Top 0.254: IC7.12 38.04,29.27 38.48,28.83 38.48,27.05 37.59,26.16 37.21,26.16 36.2,25.15 35.73,25.15 LD3.C 35.6,25.02
N$22
  Top 0.254: IC7.11 37.04,28.62 37.34,28.32 37.34,27.05 36.96,26.67 34.71,26.67 LD4.C
N$23
  Top 0.254: C5.1 43.18,8.88 X1.1 42.55,9.59 42.55,11.81 42.16,12.19 37.85,12.19 37.59,11.94 37.59,10.03 37.08,9.53 IC4.2
N$24
  Top 0.254: IC7.10 33.47,27.97 LD5.C
N$25
  Top 0.254: R15.1 LD5.A
RESET  (via drill 0.6)
  Top 0.254: IC1.4 14.68,33.35 v16,34.67
  Bottom 0.254: v16,34.67 15.62,35.05 6.27,35.05 JP3.1
SCK
  Top 0.254: IC1.3 11.44,34.15 11.05,34.54 9.4,34.54 9.02,34.16 9.02,29.77 JP3.4 4.45,26.67 2.92,28.19 2.92,36.32 3.68,37.08 8,37.08 10.6,39.68 IC3.4
SCK_1
  Top 0.254: IC5.4 10.87,23.82 11.18,24.13 15.75,24.13 16.13,24.51 16.13,26.05 IC1.13
SCL  (via drill 0.6)
  Top 0.254: 20.95,26.07 IC1.19 21.08,26.1 21.08,25.15 20.7,24.77 20.7,23.88 21.34,23.24 22.1,23.24 27.69,17.65 31.62,17.65 32.13,17.14 32.13,14.1 32.27,13.96 R7.1 33.02,11.3 32.51,10.79 IC4.6 v28.96,10.79
  Bottom 0.254: 48.26,12.19 48.26,11.94 48.77,11.43 51.82,11.43 52.32,11.94 52.32,20.07 JP1.2 | 48.26,12.19 J1.4 | v28.96,10.79 27.56,10.79 26.92,10.16 26.92,6.73 27.3,6.35 31.11,6.35 32,7.24 45.85,7.24 46.61,8 46.61,10.54 48.26,12.19
SDA  (via drill 0.6)
  Top 0.254: IC4.5 30.99,13.83 R6.1 | R6.1 29.86,13.96 29.34,14.48 29.34,16.64 28.96,17.02 27.56,17.02 22.61,21.97 v21.72,21.97 | v21.72,24.38 21.72,26.04 IC1.20 | JP2.2 46.61,21.34 46.61,14.35 46.99,13.97 49.4,13.97 50.67,12.7 J1.3 52.07,12.7 52.96,11.81 v52.96,10.92 | R6.1 29.7,13.96 v29.08,13.34
  Bottom 0.254: v21.72,21.97 v21.72,24.38 | v29.08,13.34 26.92,13.34 26.29,12.7 26.29,6.48 27.05,5.71 31.37,5.71 32.26,6.6 46.74,6.6 48.64,8.51 51.94,8.51 52.96,9.53 v52.96,10.92
SS
  Top 0.254: IC3.5 9.65,41.78 9.4,42.04 9.4,43.43 9.65,43.69 11.81,43.69 12.45,43.05 12.45,37.97 13.08,37.34 15.42,37.34 IC1.44
THERMISTOR
  Top 0.254: IC1.35 22.63,38.12 23.37,38.86 29.73,38.86 | 29.73,38.86 R1.2 | 29.73,38.86 29.73,43.07 R4.2
UART_RXD
  Top 0.254: IC8.1 15.46,9.49 14.86,8.89 10.54,8.89 8.64,10.79 8.64,25.53 9.53,26.42 10.92,26.42 11.68,27.18 11.68,28.83 12.21,29.35 IC1.9
UART_TXD  (via drill 0.6)
  Top 0.254: IC8.5 18.06,8.79 17.65,8.38 12.95,8.38 12.45,7.87 v12.45,7.37 | IC1.10 12.42,28.55 12.32,28.45 12.32,26.92 11.18,25.78 9.91,25.78 9.27,25.15 9.27,11.05 10.67,9.65 12.45,9.65 v12.7,9.91
  Bottom 0.254: v12.7,9.91 12.7,7.62 v12.45,7.37
USB_3V3  (via drill 0.6)
  Top 0.305: IC8.4 17.41,11.82 17.91,12.32 22.61,12.32 v23.62,13.34 22.61,14.35 IC8.17 v22.61,19.18
  Bottom 0.305: v23.62,13.34 C18.1 | v22.61,19.18 21.97,18.54 19.3,18.54 18.41,19.43 18.41,20.05 R16.2
USB_5V  (via drill 0.6, 0.7)
  Top 0.406: v18.29,15.24 20.07,15.24 20.7,15.88 20.7,17.5 IC8.20 | R11.2 R12.2 R13.2 R14.2 R15.2 28.72,19.67 v27.94,20.45 | v16.89,6.6 17.71,6.6 X3.VBUS
  Bottom 0.254: C16.1 17.13,13.19
  Bottom 0.406: v16.89,6.6 16.89,11.29 C17.1 17.03,13.23 C16.1 | C16.1 17.13,14.08 v18.29,15.24 18.41,15.11 26.67,15.11 27.94,16.38 v27.94,20.45 | C16.1 16.66,13.81 IC6.3 13.7,14.09 13.58,14.09 12.7,13.21 10.81,13.21 C14.1 R17.2
VCC_3V3  (via drill 0.6)
  Top 0.254: 26.25,30.95 26.89,30.95 27.43,31.5 27.43,36.58 28.19,37.34
  Top 0.305: R6.2 31.11,16.26 v30.73,16.64 | v35.18,16.64 35.18,15.51 R8.2 35.19,14.99 35.56,14.99 35.94,14.61 35.94,14.1 36.18,13.86 C4.1 36.84,13.84 42.8,13.84 46.48,10.16 J1.2 | v33.02,16.64 R7.2 | IC4.8 30.73,8 v28.57,8 27.69,8.89 27.69,15.75 22.48,20.95 20.83,20.95 19.43,22.35 v19.43,22.99 IC1.17 v19.43,28.19 | IC5.5 10.87,19.61 v11.05,19.43 11.68,18.8 R9.2 | v22.86,31.5 22.99,31.5 23.5,30.99 24.99,30.99 IC1.27 26.25,30.95 | v15.88,32.51 13.87,32.51 IC1.5 | v20.32,35.18 20.32,37.26 IC1.38 20.19,37.39 20.19,38.86 19.94,39.12 v19.81,39.12 | IC3.3 8.2,40.32 v8.89,39.62 | SENS-1.1 14.53,40.59 v14.61,40.51 | 28.19,37.34 29.73,37.34 R1.1 29.86,37.47 v31.88,37.47 | v41.78,35.56 IC2.1
  Bottom 0.305: 14.72,17.78 14.72,16.71 IC6.2 | 14.72,17.78 C15.1 14.72,20.86 C7.1 14.62,22.49 15.11,22.99 v19.43,22.99 | v35.18,16.64 v33.02,16.64 v30.73,16.64 30.73,10.16 v28.57,8 | 14.72,17.78 14.47,18.03 11.56,18.03 11.05,18.54 v11.05,19.43 6.48,19.43 5.92,19.99 JP3.6 | v19.43,28.19 19.43,29.07 C9.1 20.2,30.36 20.57,30.73 21.21,30.73 21.46,30.99 21.46,31.61 C11.1 | C11.1 21.61,32.5 21.46,32.64 21.08,32.64 20.7,33.02 20.7,33.26 C10.1 | C11.1 22.61,31.75 v22.86,31.5 | C10.1 17.02,33.66 v15.88,32.51 | C10.1 20.3,35.16 v20.32,35.18 | C3.1 7.86,39.62 v8.89,39.62 9.78,40.51 v14.61,40.51 18.91,40.51 C1.1 19.04,39.89 v19.81,39.12 | 49.5,35.58 C2.1 41.8,35.58 v41.78,35.56 33.78,35.56 v31.88,37.47 | 49.5,35.58 R3.1 | 49.5,35.58 49.5,39.54 JP4.6

### Text on the board
tPlace: Humidity | Therm1 | + | - | AD Temp | 84A | - | + | ATtiny84A | Therm 2 | TI Temp | 3244P | BB Header | RTC
bPlace: 3v3 Reg.
bNames: theWeather.system by Todd Sukolsky | Rev A | December 16, 2012
Document: 2.2" | 1.9"